# Altium schematic sheet DC_Current_Voltage_Measurement.SchDoc
size A4
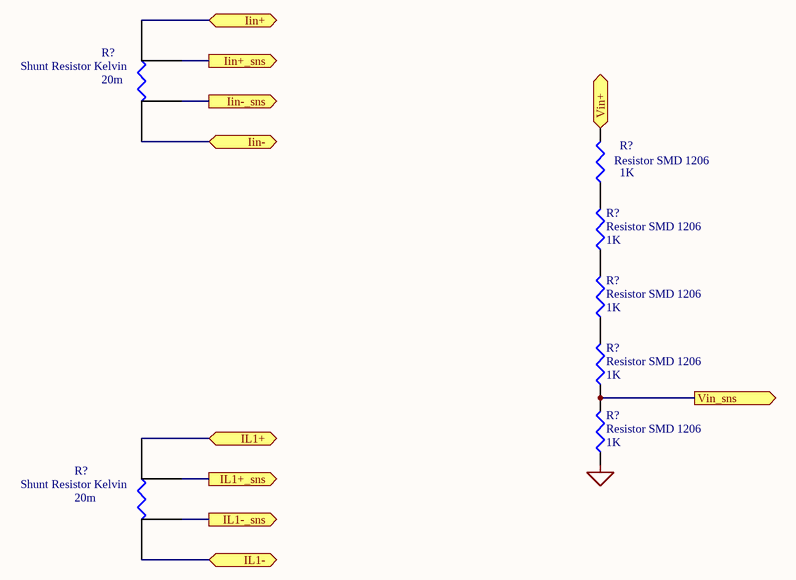
[diagram p0: DC_Current_Voltage_Measurement.SchDoc]

## Parts
(Parts that share a designator on the sheet are numbered #1, #2 ... from top to bottom, then left to right.)
R?#1  Shunt Resistor Kelvin  value 20m  [Chip2PinSM127P600-8N]
R?#2  Resistor SMD 1206  value 1K  [RESC3116X07N - 1206]
R?#3  Resistor SMD 1206  value 1K  [RESC3116X07N - 1206]
R?#4  Resistor SMD 1206  value 1K  [RESC3116X07N - 1206]
R?#5  Resistor SMD 1206  value 1K  [RESC3116X07N - 1206]
R?#6  Resistor SMD 1206  value 1K  [RESC3116X07N - 1206]
R?#7  Shunt Resistor Kelvin  value 20m  [Chip2PinSM127P600-8N]

## Ports
Iin+ (bidir), Iin+_sns (out), Iin- (bidir), Iin-_sns (out), IL1+ (bidir), IL1+_sns (out), IL1- (bidir), IL1-_sns (out), Vin+ (in), Vin_sns (out)

## Nets
SGND: R?#6.1
Iin+: R?#1.1 ; port Iin+
Iin+_sns: R?#1.2 ; port Iin+_sns
Iin-: R?#1.4 ; port Iin-
Iin-_sns: R?#1.3 ; port Iin-_sns
IL1+: R?#7.1 ; port IL1+
IL1+_sns: R?#7.2 ; port IL1+_sns
IL1-: R?#7.4 ; port IL1-
IL1-_sns: R?#7.3 ; port IL1-_sns
Vin+: R?#2.2 ; port Vin+
Vin_sns: R?#5.1 R?#6.2 ; port Vin_sns
NetR?#2_1: R?#2.1 R?#3.2
NetR?#3_1: R?#3.1 R?#4.2
NetR?#4_1: R?#4.1 R?#5.2

## Library data of the parts
R?#1 R?#7 = Shunt Resistor Kelvin: Published: 8-Jun-2000; LatestRevisionDate: 29-May-2009; LatestRevisionNote: IPC-7351 Footprint Added.; PackageReference: J1-0603; Publisher: Altium Limited; PackageDescription: Chip Resistor
R?#2-R?#6 = Resistor SMD 1206: Published: 8-Jun-2000; LatestRevisionDate: 29-May-2009; LatestRevisionNote: IPC-7351 Footprint Added.; PackageReference: J1-0603; Publisher: Altium Limited; PackageDescription: Chip Resistor